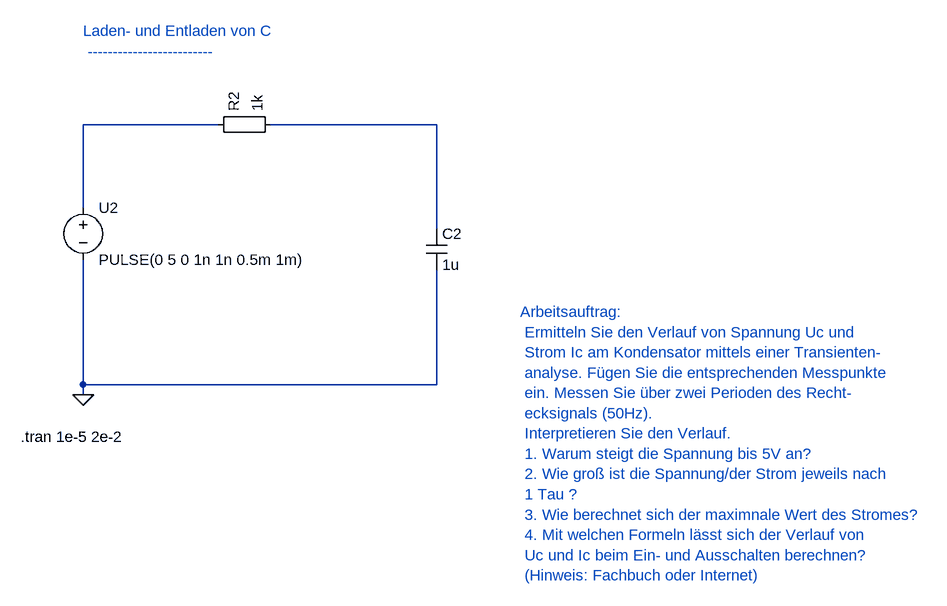
[diagram p0: schematic 1_1_3 Laden_Entladen_von_C.asc]
1_1_3 Laden_Entladen_von_C.asc, the LTspice schematic file:
Version 4
SHEET 1 880 680
WIRE 704 480 704 496
WIRE 160 464 160 480
WIRE 704 416 704 256
WIRE 704 256 448 256
WIRE 704 496 704 656
WIRE 704 656 160 656
WIRE 160 384 160 256
WIRE 160 256 368 256
WIRE 160 656 160 672
WIRE 160 480 160 656
FLAG 160 672 0
SYMBOL Misc\EuropeanResistor 352 272 R270
SYMATTR InstName R2
SYMATTR Value 1k
SYMBOL cap 688 416 R0
SYMATTR InstName C2
SYMATTR Value 1u
SYMBOL voltage 160 368 R0
SYMATTR InstName U2
SYMATTR Value PULSE(0 5 0 1n 1n 0.5m 1m)
TEXT 64 736 Left 2 !.tran 1e-5 2e-2
TEXT 160 112 Left 2 ;Laden- und Entladen von C \n -------------------------
TEXT 832 544 Left 2 ;Arbeitsauftrag: \n Ermitteln Sie den Verlauf von Spannung Uc und \n Strom Ic am Kondensator mittels einer Transienten- \n analyse. Fügen Sie die entsprechenden Messpunkte \n ein. Messen Sie über zwei Perioden des Recht- \n ecksignals (50Hz). \n Interpretieren Sie den Verlauf. \n 1. Warum steigt die Spannung bis 5V an? \n 2. Wie groß ist die Spannung/der Strom jeweils nach \n 1 Tau ? \n 3. Wie berechnet sich der maximnale Wert des Stromes? \n 4. Mit welchen Formeln lässt sich der Verlauf von \n Uc und Ic beim Ein- und Ausschalten berechnen? \n (Hinweis: Fachbuch oder Internet)

The netlist it stands for:
* 1_1_3 Laden_Entladen_von_C.asc
R2 N002 N001 1k
C2 N001 0 1u
V§U2 N002 0 PULSE(0 5 0 1n 1n 0.5m 1m)
.tran 1e-5 2e-2
* Laden- und Entladen von C
*  -------------------------
* Arbeitsauftrag:
*  Ermitteln Sie den Verlauf von Spannung Uc und
*  Strom Ic am Kondensator mittels einer Transienten-
*  analyse. Fügen Sie die entsprechenden Messpunkte
*  ein. Messen Sie über zwei Perioden des Recht-
*  ecksignals (50Hz).
*  Interpretieren Sie den Verlauf.
*  1. Warum steigt die Spannung bis 5V an?
*  2. Wie groß ist die Spannung/der Strom jeweils nach
*  1 Tau ?
*  3. Wie berechnet sich der maximnale Wert des Stromes?
*  4. Mit welchen Formeln lässt sich der Verlauf von
*  Uc und Ic beim Ein- und Ausschalten berechnen?
*  (Hinweis: Fachbuch oder Internet)
.backanno
.end